# Altium schematic sheet eBox_ACdetect.SchDoc: eBox_AC_Detect (1)
size A4; DocumentNumber: 6; SheetNumber: 6; SheetTotal: 7
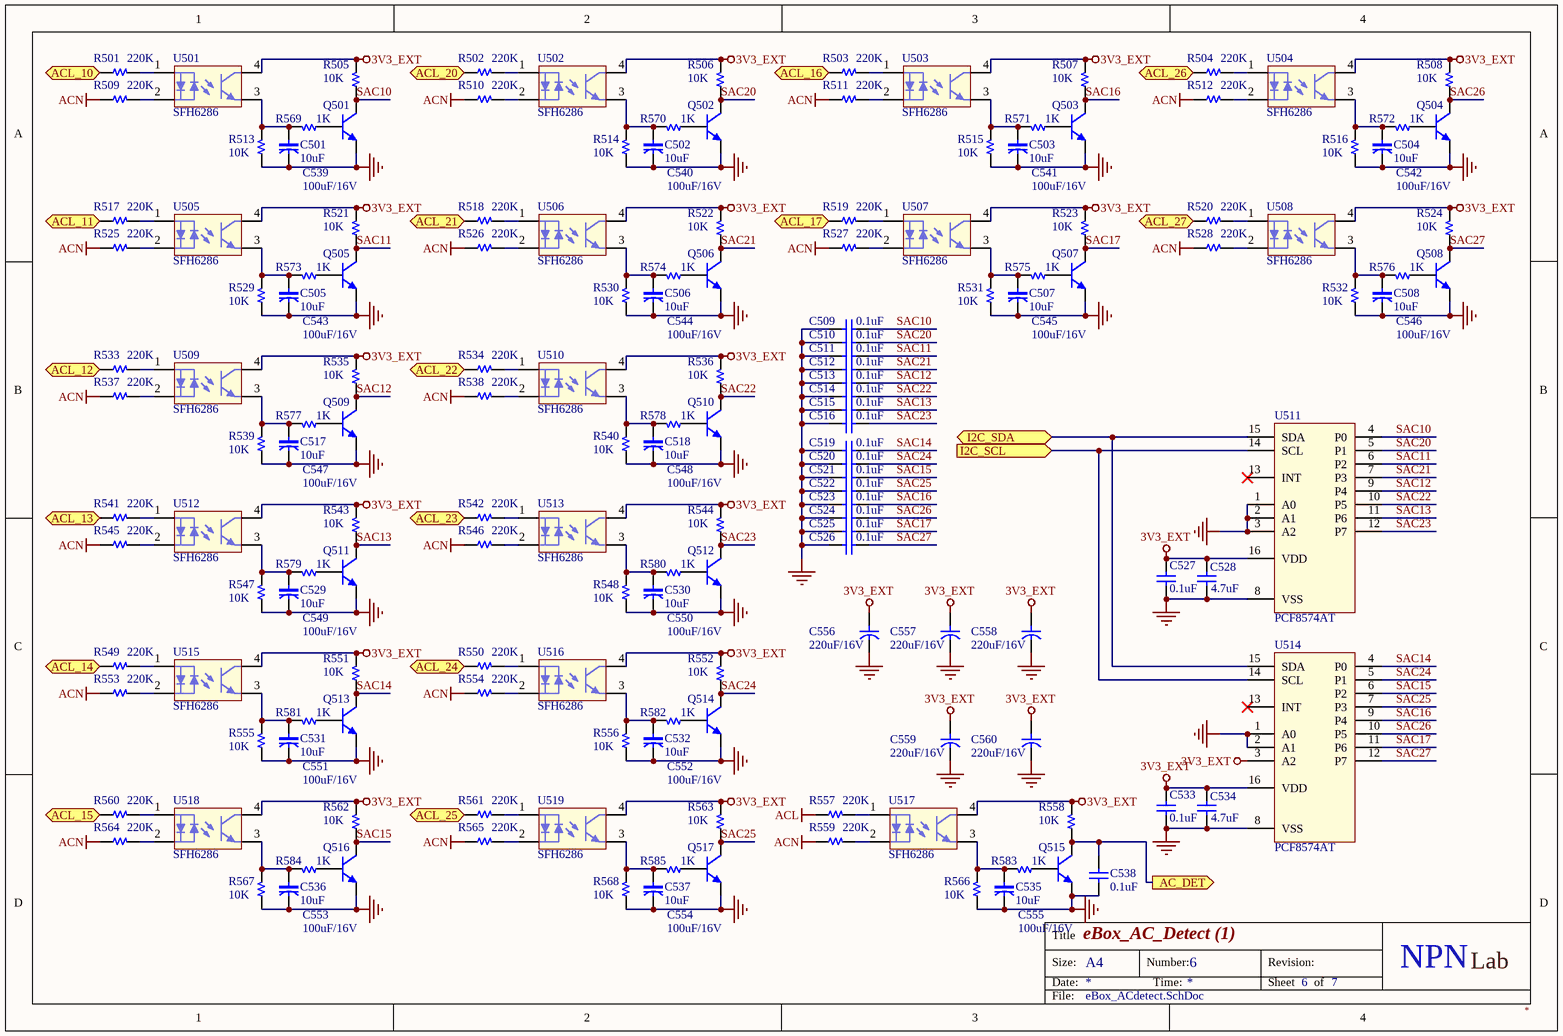
[diagram p0: eBox_ACdetect.SchDoc]

## Parts
C501  10uF  [C 0805]
C502  10uF  [C 0805]
C503  10uF  [C 0805]
C504  10uF  [C 0805]
C505  10uF  [C 0805]
C506  10uF  [C 0805]
C507  10uF  [C 0805]
C508  10uF  [C 0805]
C509  0.1uF  [C 0805]
C510  0.1uF  [C 0805]
C511  0.1uF  [C 0805]
C512  0.1uF  [C 0805]
C513  0.1uF  [C 0805]
C514  0.1uF  [C 0805]
C515  0.1uF  [C 0805]
C516  0.1uF  [C 0805]
C517  10uF  [C 0805]
C518  10uF  [C 0805]
C519  0.1uF  [C 0805]
C520  0.1uF  [C 0805]
C521  0.1uF  [C 0805]
C522  0.1uF  [C 0805]
C523  0.1uF  [C 0805]
C524  0.1uF  [C 0805]
C525  0.1uF  [C 0805]
C526  0.1uF  [C 0805]
C527  0.1uF  [C 0603]
C528  4.7uF  [C 0603]
C529  10uF  [C 0805]
C530  10uF  [C 0805]
C531  10uF  [C 0805]
C532  10uF  [C 0805]
C533  0.1uF  [C 0603]
C534  4.7uF  [C 0603]
C535  10uF  [C 0805]
C536  10uF  [C 0805]
C537  10uF  [C 0805]
C538  0.1uF  [C 0805]
C539  100uF/16V  [CYL/D.200/LS.75]  (no BOM)
C540  100uF/16V  [CYL/D.200/LS.75]  (no BOM)
C541  100uF/16V  [CYL/D.200/LS.75]  (no BOM)
C542  100uF/16V  [CYL/D.200/LS.75]  (no BOM)
C543  100uF/16V  [CYL/D.200/LS.75]  (no BOM)
C544  100uF/16V  [CYL/D.200/LS.75]  (no BOM)
C545  100uF/16V  [CYL/D.200/LS.75]  (no BOM)
C546  100uF/16V  [CYL/D.200/LS.75]  (no BOM)
C547  100uF/16V  [CYL/D.200/LS.75]  (no BOM)
C548  100uF/16V  [CYL/D.200/LS.75]  (no BOM)
C549  100uF/16V  [CYL/D.200/LS.75]  (no BOM)
C550  100uF/16V  [CYL/D.200/LS.75]  (no BOM)
C551  100uF/16V  [CYL/D.200/LS.75]  (no BOM)
C552  100uF/16V  [CYL/D.200/LS.75]  (no BOM)
C553  100uF/16V  [CYL/D.200/LS.75]  (no BOM)
C554  100uF/16V  [CYL/D.200/LS.75]  (no BOM)
C555  100uF/16V  [CYL/D.200/LS.75]  (no BOM)
C556  220uF/16V  [CYL/D.250/LS.100]
C557  220uF/16V  [CYL/D.250/LS.100]
C558  220uF/16V  [CYL/D.250/LS.100]
C559  220uF/16V  [CYL/D.250/LS.100]
C560  220uF/16V  [CYL/D.250/LS.100]
Q501  MMBT3904LT1G  [SOT-23]  (value not drawn)
Q502  MMBT3904LT1G  [SOT-23]  (value not drawn)
Q503  MMBT3904LT1G  [SOT-23]  (value not drawn)
Q504  MMBT3904LT1G  [SOT-23]  (value not drawn)
Q505  MMBT3904LT1G  [SOT-23]  (value not drawn)
Q506  MMBT3904LT1G  [SOT-23]  (value not drawn)
Q507  MMBT3904LT1G  [SOT-23]  (value not drawn)
Q508  MMBT3904LT1G  [SOT-23]  (value not drawn)
Q509  MMBT3904LT1G  [SOT-23]  (value not drawn)
Q510  MMBT3904LT1G  [SOT-23]  (value not drawn)
Q511  MMBT3904LT1G  [SOT-23]  (value not drawn)
Q512  MMBT3904LT1G  [SOT-23]  (value not drawn)
Q513  MMBT3904LT1G  [SOT-23]  (value not drawn)
Q514  MMBT3904LT1G  [SOT-23]  (value not drawn)
Q515  MMBT3904LT1G  [SOT-23]  (value not drawn)
Q516  MMBT3904LT1G  [SOT-23]  (value not drawn)
Q517  MMBT3904LT1G  [SOT-23]  (value not drawn)
R501  220K  [R 0805]
R502  220K  [R 0805]
R503  220K  [R 0805]
R504  220K  [R 0805]
R505  10K  [R 0805]
R506  10K  [R 0805]
R507  10K  [R 0805]
R508  10K  [R 0805]
R509  220K  [R 0805]
R510  220K  [R 0805]
R511  220K  [R 0805]
R512  220K  [R 0805]
R513  10K  [R 0805]
R514  10K  [R 0805]
R515  10K  [R 0805]
R516  10K  [R 0805]
R517  220K  [R 0805]
R518  220K  [R 0805]
R519  220K  [R 0805]
R520  220K  [R 0805]
R521  10K  [R 0805]
R522  10K  [R 0805]
R523  10K  [R 0805]
R524  10K  [R 0805]
R525  220K  [R 0805]
R526  220K  [R 0805]
R527  220K  [R 0805]
R528  220K  [R 0805]
R529  10K  [R 0805]
R530  10K  [R 0805]
R531  10K  [R 0805]
R532  10K  [R 0805]
R533  220K  [R 0805]
R534  220K  [R 0805]
R535  10K  [R 0805]
R536  10K  [R 0805]
R537  220K  [R 0805]
R538  220K  [R 0805]
R539  10K  [R 0805]
R540  10K  [R 0805]
R541  220K  [R 0805]
R542  220K  [R 0805]
R543  10K  [R 0805]
R544  10K  [R 0805]
R545  220K  [R 0805]
R546  220K  [R 0805]
R547  10K  [R 0805]
R548  10K  [R 0805]
R549  220K  [R 0805]
R550  220K  [R 0805]
R551  10K  [R 0805]
R552  10K  [R 0805]
R553  220K  [R 0805]
R554  220K  [R 0805]
R555  10K  [R 0805]
R556  10K  [R 0805]
R557  220K  [R 0805]
R558  10K  [R 0805]
R559  220K  [R 0805]
R560  220K  [R 0805]
R561  220K  [R 0805]
R562  10K  [R 0805]
R563  10K  [R 0805]
R564  220K  [R 0805]
R565  220K  [R 0805]
R566  10K  [R 0805]
R567  10K  [R 0805]
R568  10K  [R 0805]
R569  1K  [R 0805]
R570  1K  [R 0805]
R571  1K  [R 0805]
R572  1K  [R 0805]
R573  1K  [R 0805]
R574  1K  [R 0805]
R575  1K  [R 0805]
R576  1K  [R 0805]
R577  1K  [R 0805]
R578  1K  [R 0805]
R579  1K  [R 0805]
R580  1K  [R 0805]
R581  1K  [R 0805]
R582  1K  [R 0805]
R583  1K  [R 0805]
R584  1K  [R 0805]
R585  1K  [R 0805]
U501  SFH6286  [SOP4 - SFH6286]
U502  SFH6286  [SOP4 - SFH6286]
U503  SFH6286  [SOP4 - SFH6286]
U504  SFH6286  [SOP4 - SFH6286]
U505  SFH6286  [SOP4 - SFH6286]
U506  SFH6286  [SOP4 - SFH6286]
U507  SFH6286  [SOP4 - SFH6286]
U508  SFH6286  [SOP4 - SFH6286]
U509  SFH6286  [SOP4 - SFH6286]
U510  SFH6286  [SOP4 - SFH6286]
U511  PCF8574AT  [SO16/PCF8574AT]
U512  SFH6286  [SOP4 - SFH6286]
U513  SFH6286  [SOP4 - SFH6286]
U514  PCF8574AT  [SO16/PCF8574AT]
U515  SFH6286  [SOP4 - SFH6286]
U516  SFH6286  [SOP4 - SFH6286]
U517  SFH6286  [SOP4 - SFH6286]
U518  SFH6286  [SOP4 - SFH6286]
U519  SFH6286  [SOP4 - SFH6286]

## Ports
AC_DET (out), ACL_10 (in), ACL_11 (in), ACL_12 (in), ACL_13 (in), ACL_14 (in), ACL_15 (in), ACL_16 (in), ACL_17 (in), ACL_20 (in), ACL_21 (in), ACL_22 (in), ACL_23 (in), ACL_24 (in), ACL_25 (in), ACL_26 (in), ACL_27 (in), I2C_SCL (in), I2C_SDA (bidir)

## Nets
3V3_EXT: C527.1 C528.1 C533.1 C534.1 C556.1 C557.1 C558.1 C559.1 C560.1 R505.2 R506.2 R507.2 R508.2 R521.2 R522.2 R523.2 R524.2 R535.2 R536.2 R543.2 R544.2 R551.2 R552.2 R558.2 R562.2 R563.2 U501.4(C) U502.4(C) U503.4(C) U504.4(C) U505.4(C) U506.4(C) U507.4(C) U508.4(C) U509.4(C) U510.4(C) U511.16(VDD) U512.4(C) U513.4(C) U514.3(A2) U514.16(VDD) U515.4(C) U516.4(C) U517.4(C) U518.4(C) U519.4(C)
ACL: R557.1
ACN: R509.1 R510.1 R511.1 R512.1 R525.1 R526.1 R527.1 R528.1 R537.1 R538.1 R545.1 R546.1 R553.1 R554.1 R559.1 R564.1 R565.1
GND: C501.2 C502.2 C503.2 C504.2 C505.2 C506.2 C507.2 C508.2 C509.1 C510.1 C511.1 C512.1 C513.1 C514.1 C515.1 C516.1 C517.2 C518.2 C519.1 C520.1 C521.1 C522.1 C523.1 C524.1 C525.1 C526.1 C527.2 C528.2 C529.2 C530.2 C531.2 C532.2 C533.2 C534.2 C535.2 C536.2 C537.2 C538.1 C539.2 C540.2 C541.2 C542.2 C543.2 C544.2 C545.2 C546.2 C547.2 C548.2 C549.2 C550.2 C551.2 C552.2 C553.2 C554.2 C555.2 C556.2 C557.2 C558.2 C559.2 C560.2 Q501.2(E) Q502.2(E) Q503.2(E) Q504.2(E) Q505.2(E) Q506.2(E) Q507.2(E) Q508.2(E) Q509.2(E) Q510.2(E) Q511.2(E) Q512.2(E) Q513.2(E) Q514.2(E) Q515.2(E) Q516.2(E) Q517.2(E) R513.1 R514.1 R515.1 R516.1 R529.1 R530.1 R531.1 R532.1 R539.1 R540.1 R547.1 R548.1 R555.1 R556.1 R566.1 R567.1 R568.1 U511.1(A0) U511.2(A1) U511.3(A2) U511.8(VSS) U514.1(A0) U514.2(A1) U514.8(VSS)
AC_DET: C538.2 Q515.3(C) R558.1 ; port AC_DET
ACL_10: R501.1 ; port ACL_10
ACL_11: R517.1 ; port ACL_11
ACL_12: R533.1 ; port ACL_12
ACL_13: R541.1 ; port ACL_13
ACL_14: R549.1 ; port ACL_14
ACL_15: R560.1 ; port ACL_15
ACL_16: R503.1 ; port ACL_16
ACL_17: R519.1 ; port ACL_17
ACL_20: R502.1 ; port ACL_20
ACL_21: R518.1 ; port ACL_21
ACL_22: R534.1 ; port ACL_22
ACL_23: R542.1 ; port ACL_23
ACL_24: R550.1 ; port ACL_24
ACL_25: R561.1 ; port ACL_25
ACL_26: R504.1 ; port ACL_26
ACL_27: R520.1 ; port ACL_27
I2C_SCL: U511.14(SCL) U514.14(SCL) ; port I2C_SCL
I2C_SDA: U511.15(SDA) U514.15(SDA) ; port I2C_SDA
SAC10: C509.2 Q501.3(C) R505.1 U511.4(P0)
SAC11: C511.2 Q505.3(C) R521.1 U511.6(P2)
SAC12: C513.2 Q509.3(C) R535.1 U511.9(P4)
SAC13: C515.2 Q511.3(C) R543.1 U511.11(P6)
SAC14: C519.2 Q513.3(C) R551.1 U514.4(P0)
SAC15: C521.2 Q516.3(C) R562.1 U514.6(P2)
SAC16: C523.2 Q503.3(C) R507.1 U514.9(P4)
SAC17: C525.2 Q507.3(C) R523.1 U514.11(P6)
SAC20: C510.2 Q502.3(C) R506.1 U511.5(P1)
SAC21: C512.2 Q506.3(C) R522.1 U511.7(P3)
SAC22: C514.2 Q510.3(C) R536.1 U511.10(P5)
SAC23: C516.2 Q512.3(C) R544.1 U511.12(P7)
SAC24: C520.2 Q514.3(C) R552.1 U514.5(P1)
SAC25: C522.2 Q517.3(C) R563.1 U514.7(P3)
SAC26: C524.2 Q504.3(C) R508.1 U514.10(P5)
SAC27: C526.2 Q508.3(C) R524.1 U514.12(P7)
NetC501_1: C501.1 C539.1 R513.2 R569.2 U501.3(E)
NetC502_1: C502.1 C540.1 R514.2 R570.2 U502.3(E)
NetC503_1: C503.1 C541.1 R515.2 R571.2 U503.3(E)
NetC504_1: C504.1 C542.1 R516.2 R572.2 U504.3(E)
NetC505_1: C505.1 C543.1 R529.2 R573.2 U505.3(E)
NetC506_1: C506.1 C544.1 R530.2 R574.2 U506.3(E)
NetC507_1: C507.1 C545.1 R531.2 R575.2 U507.3(E)
NetC508_1: C508.1 C546.1 R532.2 R576.2 U508.3(E)
NetC517_1: C517.1 C547.1 R539.2 R577.2 U509.3(E)
NetC518_1: C518.1 C548.1 R540.2 R578.2 U510.3(E)
NetC529_1: C529.1 C549.1 R547.2 R579.2 U512.3(E)
NetC530_1: C530.1 C550.1 R548.2 R580.2 U513.3(E)
NetC531_1: C531.1 C551.1 R555.2 R581.2 U515.3(E)
NetC532_1: C532.1 C552.1 R556.2 R582.2 U516.3(E)
NetC535_1: C535.1 C555.1 R566.2 R583.2 U517.3(E)
NetC536_1: C536.1 C553.1 R567.2 R584.2 U518.3(E)
NetC537_1: C537.1 C554.1 R568.2 R585.2 U519.3(E)
NetQ501_1: Q501.1(B) R569.1
NetQ502_1: Q502.1(B) R570.1
NetQ503_1: Q503.1(B) R571.1
NetQ504_1: Q504.1(B) R572.1
NetQ505_1: Q505.1(B) R573.1
NetQ506_1: Q506.1(B) R574.1
NetQ507_1: Q507.1(B) R575.1
NetQ508_1: Q508.1(B) R576.1
NetQ509_1: Q509.1(B) R577.1
NetQ510_1: Q510.1(B) R578.1
NetQ511_1: Q511.1(B) R579.1
NetQ512_1: Q512.1(B) R580.1
NetQ513_1: Q513.1(B) R581.1
NetQ514_1: Q514.1(B) R582.1
NetQ515_1: Q515.1(B) R583.1
NetQ516_1: Q516.1(B) R584.1
NetQ517_1: Q517.1(B) R585.1
NetR501_2: R501.2 U501.1(A/C)
NetR502_2: R502.2 U502.1(A/C)
NetR503_2: R503.2 U503.1(A/C)
NetR504_2: R504.2 U504.1(A/C)
NetR509_2: R509.2 U501.2(C/A)
NetR510_2: R510.2 U502.2(C/A)
NetR511_2: R511.2 U503.2(C/A)
NetR512_2: R512.2 U504.2(C/A)
NetR517_2: R517.2 U505.1(A/C)
NetR518_2: R518.2 U506.1(A/C)
NetR519_2: R519.2 U507.1(A/C)
NetR520_2: R520.2 U508.1(A/C)
NetR525_2: R525.2 U505.2(C/A)
NetR526_2: R526.2 U506.2(C/A)
NetR527_2: R527.2 U507.2(C/A)
NetR528_2: R528.2 U508.2(C/A)
NetR533_2: R533.2 U509.1(A/C)
NetR534_2: R534.2 U510.1(A/C)
NetR537_2: R537.2 U509.2(C/A)
NetR538_2: R538.2 U510.2(C/A)
NetR541_2: R541.2 U512.1(A/C)
NetR542_2: R542.2 U513.1(A/C)
NetR545_2: R545.2 U512.2(C/A)
NetR546_2: R546.2 U513.2(C/A)
NetR549_2: R549.2 U515.1(A/C)
NetR550_2: R550.2 U516.1(A/C)
NetR553_2: R553.2 U515.2(C/A)
NetR554_2: R554.2 U516.2(C/A)
NetR557_2: R557.2 U517.1(A/C)
NetR559_2: R559.2 U517.2(C/A)
NetR560_2: R560.2 U518.1(A/C)
NetR561_2: R561.2 U519.1(A/C)
NetR564_2: R564.2 U518.2(C/A)
NetR565_2: R565.2 U519.2(C/A)

Not connected (* = marked no-connect by the designer): U511 13(INT)*; U514 13(INT)*

## Notes on the sheet
- Title
- Size:
- Date:
- A4
- Number:
- Time:
- Revision:
- Sheet
- of
- NPN
- Lab
- File:

## Library data of the parts
C501-C526 C529-C532 C535-C538 = Capacitor NP: CAP CER 0.1UF 50V X7R 0805; TYPE: SMD; PACKAGE: SMD0805; STOCK CODE: CL21B104KBNC; SUPPLIER: tme.vn; STOCK DESC: 100nF/50V ±10% X7R SMD-0805 Capacitor; UNIT PRICE: 500
C527 C533 = Capacitor NP: CAP CER 0.1UF 50V X7R 0603; TYPE: SMD; PACKAGE: SMD0603; STOCK CODE: CC0603KRX7R9BB104; SUPPLIER: tme.vn; STOCK DESC: 100nF/50V ±10% X7R SMD-0603 Capacitor; UNIT PRICE: 400
C528 C534 = Capacitor NP: CAP CER 4.7UF 50V X7R 0603; TYPE: SMD; PACKAGE: SMD0603; STOCK CODE: CC0603KRX5R6BB475; SUPPLIER: tme.vn; STOCK DESC: 4.7uF 10V ±10% X5R SMD-0603 Capacitor; UNIT PRICE: 600
C539-C555 = Capacitor: Capacitor pol
C556-C560 = Capacitor: CAP TANT 100UF 20% 16V 2917; TYPE: SMD; PACKAGE: SMD7343; STOCK CODE: TAJD107M016RNJ; SUPPLIER: tme.vn; STOCK DESC: 100uF/16V ±20% SMD Tantalum Capacitor; UNIT PRICE: 9000
Q501-Q517 = Transistor NPN: TRANS NPN 40V 0.2A SOT23; TYPE: SMD; STOCK CODE: LMBT3904LT1G; SUPPLIER: tme.vn; STOCK DESC: NPN General-Purpose Amplifier SMD Transistor; UNIT PRICE: 600
R501-R504 R509-R512 R517-R520 R525-R528 R533 R534 R537 R538 R541 R542 R545 R546 R549 R550 R553 R554 R557 R559-R561 R564 R565 = Resistor: RES SMD 220K OHM 1% 1/8W 0805; PACKAGE: SMD0805; STOCK CODE: RM10JTN224; SUPPLIER: tme.vn; TYPE: SMD; STOCK DESC: 220K 5% SMD-0805 Resistor; UNIT PRICE: 60
R505-R508 R513-R516 R521-R524 R529-R532 R535 R536 R539 R540 R543 R544 R547 R548 R551 R552 R555 R556 R558 R562 R563 R566-R585 = Resistor: RES SMD 10K OHM 1% 1/8W 0805; PACKAGE: SMD0805; STOCK CODE: RM10JTN103; SUPPLIER: tme.vn; TYPE: SMD; STOCK DESC: 10K 5% SMD-0805 Resistor; UNIT PRICE: 60
U511 U514 = PCF8574AT: Remote 8-bit I/O expander for I2C-bus with interrupt; PART NO: PCF8574AT/3; BRAND: NXP; PACKAGE: SO16; SUPPLIER: CHINA; TYPE: SMD; UNIT PRICE: 6160
U501-U510 U512 U513 U515-U519 = SFH6286: SUPPLIER: CHINA; TYPE: SMD; UNIT PRICE: 3600